# Altium schematic sheet Top Level Hierarchy.SchDoc: Top Level Design
size B; Date: 24-02-02; CheckedBy: Jude THibeault; Author: Kyle Dick; Engineer: Kyle DIck; Revision: 0; SheetNumber: 1; SheetTotal: 10
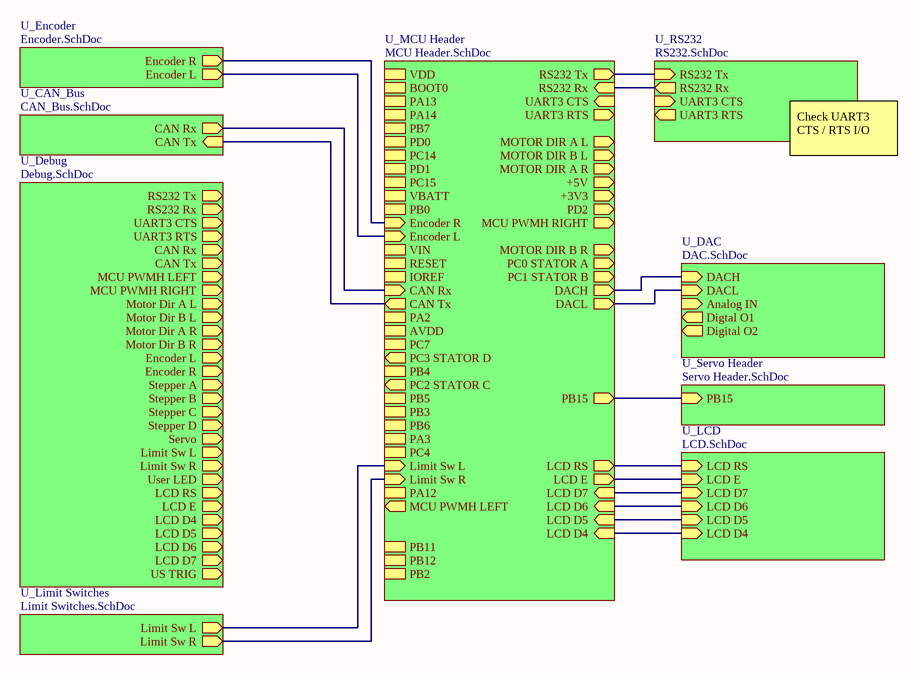
[diagram p0: Top Level Hierarchy.SchDoc]

## Sub-sheets
U_CAN_Bus = CAN_Bus.SchDoc: CAN Rx (out), CAN Tx (in)
U_DAC = DAC.SchDoc: DACH (in), DACL (in), Digtal O1 (out), Digital O2 (out), Analog IN (in)
U_Debug = Debug.SchDoc: RS232 Tx (out), RS232 Rx (out), UART3 CTS (out), UART3 RTS (out), CAN Rx (out), CAN Tx (out), MCU PWMH LEFT (out), MCU PWMH RIGHT (out), Motor Dir A L (out), Motor Dir B L (out), Motor Dir A R (out), Motor Dir B R (out), Encoder L (out), Encoder R (out), Stepper A (out), Stepper B (out), Stepper C (out), Stepper D (out), Servo (out), Limit Sw L (out), Limit Sw R (out), User LED (out), LCD RS (out), LCD E (out), LCD D4 (out), LCD D5 (out), LCD D6 (out), LCD D7 (out), US TRIG (out)
U_Encoder = Encoder.SchDoc: Encoder L (out), Encoder R (out)
U_LCD = LCD.SchDoc: LCD RS (in), LCD E (in), LCD D7 (in), LCD D6 (in), LCD D5 (in), LCD D4 (in)
U_Limit Switches = Limit Switches.SchDoc: Limit Sw L (out), Limit Sw R (out)
U_MCU Header = MCU Header.SchDoc: PC0 STATOR A (out), PC1 STATOR B (out), PC2 STATOR C (out), PC3 STATOR D (out), VDD, MCU PWMH LEFT (out), BOOT0, MOTOR DIR A L (out), PA13, PA14, PB7, MOTOR DIR B L (out), PD0, PC14, PD1, PC15, VBATT, PB0, Encoder R (in), Encoder L (in), VIN, +5V (out), +3V3 (out), RESET, IOREF, PD2 (out), MCU PWMH RIGHT (out), LCD D6 (in), PA2, CAN Tx (out), MOTOR DIR B R (out), AVDD, CAN Rx (in), LCD RS (out), PC7, LCD E (out), LCD D5 (in), PB4, LCD D4 (in), PB5, RS232 Tx (out), PB3, PB6, PA3, PC4, Limit Sw L (in), MOTOR DIR A R (out), Limit Sw R (in), PA12, LCD D7 (in), PB12, PB2, UART3 CTS (in), RS232 Rx (in), UART3 RTS (out), PB15 (out), PB11, DACL (out), DACH (out)
U_RS232 = RS232.SchDoc: RS232 Tx (in), RS232 Rx (out), UART3 CTS (in), UART3 RTS (out)
U_Servo Header = Servo Header.SchDoc: PB15 (in)

## Nets
(unnamed): sheet U_MCU Header/Encoder R, sheet U_Encoder/Encoder R
(unnamed): sheet U_MCU Header/Encoder L, sheet U_Encoder/Encoder L
(unnamed): sheet U_MCU Header/LCD D6, sheet U_LCD/LCD D6
(unnamed): sheet U_MCU Header/CAN Tx, sheet U_CAN_Bus/CAN Tx
(unnamed): sheet U_MCU Header/CAN Rx, sheet U_CAN_Bus/CAN Rx
(unnamed): sheet U_MCU Header/LCD RS, sheet U_LCD/LCD RS
(unnamed): sheet U_MCU Header/LCD E, sheet U_LCD/LCD E
(unnamed): sheet U_MCU Header/LCD D5, sheet U_LCD/LCD D5
(unnamed): sheet U_MCU Header/LCD D4, sheet U_LCD/LCD D4
(unnamed): sheet U_MCU Header/RS232 Tx, sheet U_RS232/RS232 Tx
(unnamed): sheet U_MCU Header/Limit Sw L, sheet U_Limit Switches/Limit Sw L
(unnamed): sheet U_MCU Header/Limit Sw R, sheet U_Limit Switches/Limit Sw R
(unnamed): sheet U_MCU Header/LCD D7, sheet U_LCD/LCD D7
(unnamed): sheet U_MCU Header/RS232 Rx, sheet U_RS232/RS232 Rx
(unnamed): sheet U_MCU Header/PB15, sheet U_Servo Header/PB15
(unnamed): sheet U_MCU Header/DACL, sheet U_DAC/DACL
(unnamed): sheet U_MCU Header/DACH, sheet U_DAC/DACH

## Notes on the sheet
- Check UART3 CTS / RTS I/O
- ESE
- is the sole property of ESE. Any reproduction
- The Information Contained in this drawing
- Schematic P/N and Name
- Sheet Name
- 850 Fountain St. S.
- Cambridge, ON N3H 0A8
- Canada
- Approved
- in part or in whole without the written
- permission of ESE is strictly prohibited.
- APPROVALS
- DATE
- Size
- Scale
- B
- NTS
- Bare PCB P/N
- Date
- Sheet
- Rev.
- Checked
- Created
- of